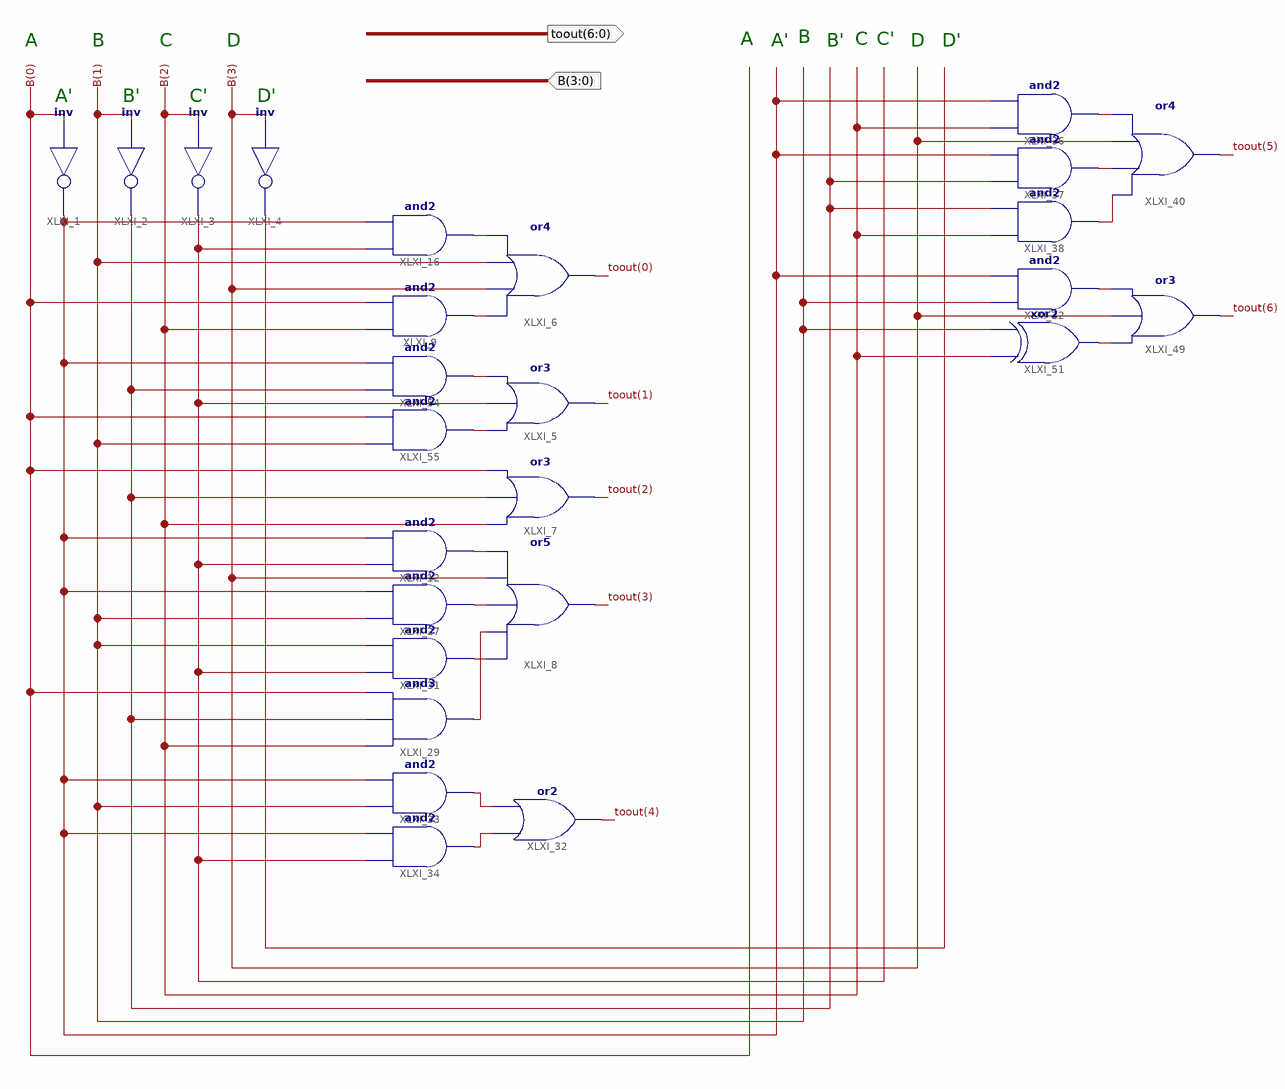
[diagram p0: schematic sheet 1]
// Xilinx ISE schematic sevensegmentBus.sch (spartan6) as structural Verilog: 26 symbols, 2 ports
module sevensegmentBus (
  input  [3:0] B,
  output [6:0] toout
);

  wire P661, XLXN_1, XLXN_2, XLXN_3, XLXN_4, XLXN_5, XLXN_9, XLXN_10, XLXN_11, XLXN_12, XLXN_30, XLXN_33,
       XLXN_37, XLXN_38, XLXN_47, XLXN_48, XLXN_49, XLXN_65, XLXN_66;

  not XLXI_1 (XLXN_30, B[0]);
  not XLXI_2 (XLXN_33, B[1]);
  not XLXI_3 (P661, B[2]);
  not XLXI_4 (XLXN_1, B[3]);
  or XLXI_5 (toout[1], XLXN_5, P661, XLXN_4);
  or XLXI_6 (toout[0], XLXN_3, B[3], B[1], XLXN_2);
  or XLXI_7 (toout[2], B[2], XLXN_33, B[0]);
  or XLXI_8 (toout[3], XLXN_11, XLXN_12, XLXN_10, B[3], XLXN_9);
  and XLXI_31 (XLXN_11, P661, B[1]);
  and XLXI_29 (XLXN_12, B[2], XLXN_33, B[0]);
  and XLXI_27 (XLXN_10, B[1], XLXN_30);
  and XLXI_12 (XLXN_9, P661, XLXN_30);
  and XLXI_33 (XLXN_37, B[1], XLXN_30);
  and XLXI_34 (XLXN_38, P661, XLXN_30);
  or XLXI_32 (toout[4], XLXN_38, XLXN_37);
  and XLXI_16 (XLXN_2, P661, XLXN_30);
  and XLXI_36 (XLXN_47, B[2], XLXN_30);
  and XLXI_37 (XLXN_48, XLXN_33, XLXN_30);
  and XLXI_38 (XLXN_49, B[2], XLXN_33);
  or XLXI_40 (toout[5], XLXN_49, XLXN_48, B[3], XLXN_47);
  or XLXI_49 (toout[6], XLXN_66, B[3], XLXN_65);
  and XLXI_22 (XLXN_65, B[1], XLXN_30);
  xor XLXI_51 (XLXN_66, B[2], B[1]);
  and XLXI_9 (XLXN_3, B[2], B[0]);
  and XLXI_54 (XLXN_4, XLXN_33, XLXN_30);
  and XLXI_55 (XLXN_5, B[1], B[0]);

  // Notes on the sheet:
  //   B
  //   A
  //   C
  //   C'
  //   A
  //   B
  //   C
  //   D
  //   A'
  //   B'
  //   D
  //   D'
  //   A'
  //   B'
  //   C'
  //   D'
endmodule
